# EAGLE design schematic (EAGLE 9.6.2)
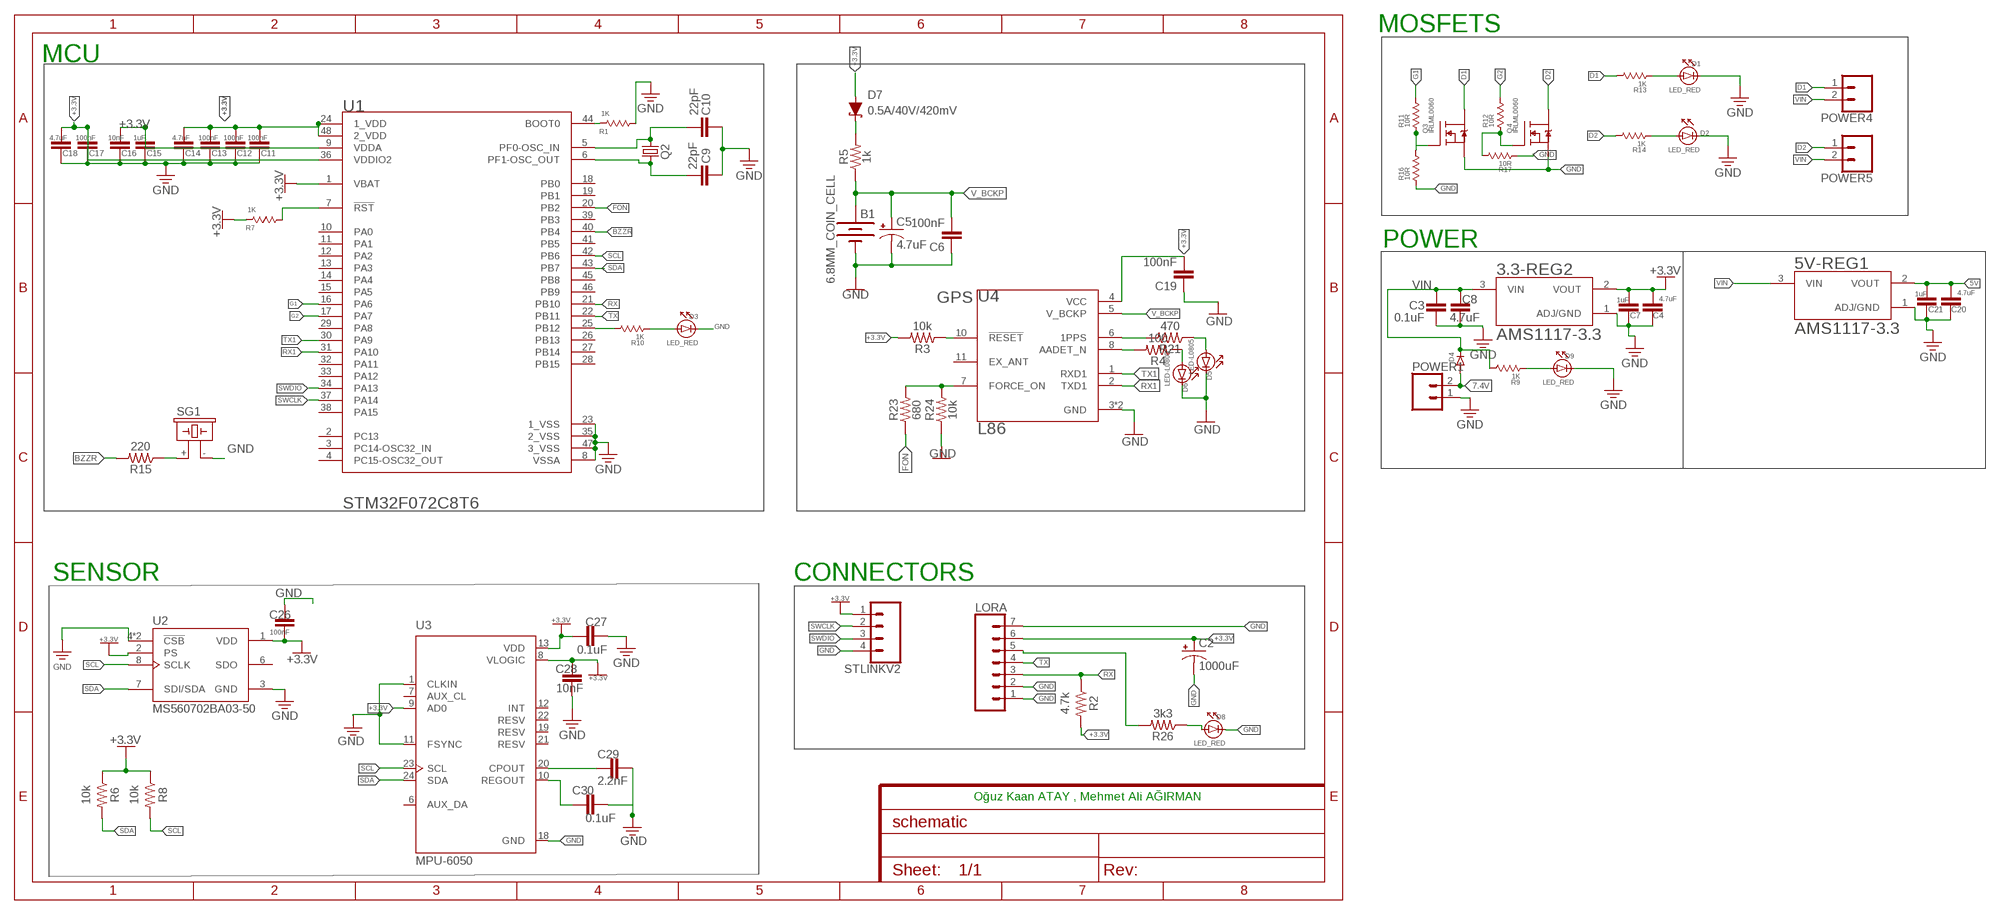
[diagram p0: schematic, sheet 1]

## Parts
3.3-REG2  AMS1117-3.3  [SOT229P700X180-4N]
5V-REG1  AMS1117-3.3  [SOT229P700X180-4N]
B1  6.8MM_COIN_CELL  BATTERY-6.8MM_SMD  [BATTCON-6.8MM]
C2  1000uF  CPOL-US150CLZ-1010  [150CLZ-1010]
C3  0.1uF  C_CHIP-0603(1608-METRIC)  [CAPC1608X85]
C4  4.7uF  C_CHIP-0603(1608-METRIC)  [CAPC1608X85]
C5  4.7uF  10UF-POLAR-EIA3216-16V-10%(TANT)  [EIA3216]
C6  100nF  1.0UF-0603-16V-10%  [0603]
C7  1uF  C_CHIP-0603(1608-METRIC)  [CAPC1608X85]
C8  4.7uF  C_CHIP-0603(1608-METRIC)  [CAPC1608X85]
C9  22pF  C_CHIP-0603(1608-METRIC)  [CAPC1608X85]
C10  22pF  C_CHIP-0603(1608-METRIC)  [CAPC1608X85]
C11  100nF  C_CHIP-0603(1608-METRIC)  [CAPC1608X85]
C12  100nF  C_CHIP-0603(1608-METRIC)  [CAPC1608X85]
C13  100nF  C_CHIP-0603(1608-METRIC)  [CAPC1608X85]
C14  4.7uF  C_CHIP-0603(1608-METRIC)  [CAPC1608X85]
C15  1uF  C_CHIP-0603(1608-METRIC)  [CAPC1608X85]
C16  10nF  C_CHIP-0603(1608-METRIC)  [CAPC1608X85]
C17  100nF  C_CHIP-0603(1608-METRIC)  [CAPC1608X85]
C18  4.7uF  C_CHIP-0603(1608-METRIC)  [CAPC1608X85]
C19  100nF  1.0UF-0603-16V-10%  [0603]
C20  4.7uF  C_CHIP-0603(1608-METRIC)  [CAPC1608X85]
C21  1uF  C_CHIP-0603(1608-METRIC)  [CAPC1608X85]
C26  100nF  C_CHIP-0603(1608-METRIC)  [CAPC1608X85]
C27  0.1uF  C_CHIP-0603(1608-METRIC)  [CAPC1608X85]
C28  10nF  C_CHIP-0603(1608-METRIC)  [CAPC1608X85]
C29  2.2nF  C_CHIP-0603(1608-METRIC)  [CAPC1608X85]
C30  0.1uF  C_CHIP-0603(1608-METRIC)  [CAPC1608X85]
D1  LED_RED  LED-L0805  [LED_0805]
D2  LED_RED  LED-L0805  [LED_0805]
D3  LED_RED  LED-L0805  [LED_0805]
D4  DIODE-SS14-DO214AC  [DO-214AC]
D5  LED-L0805  [LED_0805]
D6  LED-L0805  [LED_0805]
D7  0.5A/40V/420mV  DIODE-SCHOTTKY-PMEG4005EJ  [SOD-323]
D8  LED_RED  LED-L0805  [LED_0805]
D9  LED_RED  LED-L0805  [LED_0805]
LORA  CONN_07  [1X07]
POWER1  CONN_023.5MM-NO_SILK  [SCREWTERMINAL-3.5MM-2-NS]
POWER4  CONN_023.5MM-NO_SILK  [SCREWTERMINAL-3.5MM-2-NS]
POWER5  CONN_023.5MM-NO_SILK  [SCREWTERMINAL-3.5MM-2-NS]
Q2  CRYSTALHC49U70  [HC49U70]
Q3  IRLML0060  N_CH_MOSFET-SOT23  [SOT-23]
Q4  IRLML0060  N_CH_MOSFET-SOT23  [SOT-23]
R1  1K  RES-R0805  [RES_0805]
R2  4.7k  R-US_CHIP-0805(2012-METRIC)  [RESC2012X65]
R3  10k  1KOHM-0603-1/10W-1%  [0603]
R4  100  1KOHM-0603-1/10W-1%  [0603]
R5  1k  1KOHM-0603-1/10W-1%  [0603]
R6  10k  R-US_CHIP-0805(2012-METRIC)  [RESC2012X65]
R7  1K  RES-R0805  [RES_0805]
R8  10k  R-US_CHIP-0805(2012-METRIC)  [RESC2012X65]
R9  1K  RES-R0805  [RES_0805]
R10  1K  RES-R0805  [RES_0805]
R11  10R  RES-R0805  [RES_0805]
R12  10R  RES-R0805  [RES_0805]
R13  1K  RES-R0805  [RES_0805]
R14  1K  RES-R0805  [RES_0805]
R15  220  1KOHM-0603-1/10W-1%  [0603]
R16  10R  RES-R0805  [RES_0805]
R17  10R  RES-R0805  [RES_0805]
R21  470  1KOHM-0603-1/10W-1%  [0603]
R23  680  1KOHM-0603-1/10W-1%  [0603]
R24  10k  1KOHM-0603-1/10W-1%  [0603]
R26  3k3  1KOHM-0603-1/10W-1%  [0603]
SG1  F/CM12P  [F/CM12P]
STLINKV2  CONN_04  [1X04]
U1  STMICROELECTRONICS_STM32F072C8T6STMICROELECTRONICS_STM32F072C8T6_0_0  [STMICROELECTRONICS_STM32F072C8T6_0]
U2  MS560702BA03-50  [SON125P300X500X100-8N]
U3  MPU-6050  [QFN50P400X400X95-24N]
U4  L86  [XCVR_L86]

## Nets
5V: 5V-REG1.2(VOUT) C20.1 C21.1
7.4V: D4.A(ANOT) POWER1.2
+3.3V: 3.3-REG2.2(VOUT) C2.+ C4.1 C7.1 C11.1 C12.1 C13.1 C14.1 C15.1 C16.1 C17.1 C18.1 C19.2 C26.1 C27.2 C28.2 D7.A LORA.6 R2.2 R3.2 R6.1 R7.B R8.1 STLINKV2.1 U1.1(VBAT) U1.9(VDDA) U1.24(1_VDD) U1.36(VDDIO2) U1.48(2_VDD) U2.1(VDD) U2.2(PS) U3.8(VLOGIC) U3.9(AD0) U3.13(VDD) U4.4(VCC)
AUX: LORA.5 R26.2
BZZR: R15.2 U1.40(PB4)
D1: POWER4.1 Q3.3(D) R13.B
D2: POWER5.1 Q4.3(D) R14.B
FON: R23.1 U1.20(PB2)
G1: R11.B U1.16(PA6)
G2: R12.B U1.17(PA7)
GND: 3.3-REG2.1(ADJ/GND) 5V-REG1.1(ADJ/GND) B1.- C2.- C3.1 C4.2 C5.- C6.1 C7.2 C8.1 C9.2 C10.2 C11.2 C12.2 C13.2 C14.2 C15.2 C16.2 C17.2 C18.2 C19.1 C20.2 C21.2 C26.2 C27.1 C28.1 C29.1 C30.1 D1.K(KATOT) D2.K(KATOT) D3.K(KATOT) D5.K(KATOT) D6.K(KATOT) D8.K(KATOT) D9.K(KATOT) LORA.1 LORA.2 LORA.7 POWER1.1 Q3.2(S) Q4.2(S) R1.A R16.A R17.A R24.1 SG1.- STLINKV2.4 U1.8(VSSA) U1.23(1_VSS) U1.35(2_VSS) U1.47(3_VSS) U2.3(GND) U2.4(!CSB) U2.5(!CSB) U3.1(CLKIN) U3.11(FSYNC) U3.18(GND) U4.3(GND) U4.12(GND)
N$1: R3.1 U4.10(!RESET)
N$2: R4.2 U4.8(AADET_N)
N$3: D6.A(ANOT) R4.1
N$4: D7.C R5.2
N$5: R1.B U1.44(BOOT0)
N$6: C29.2 U3.20(CPOUT)
N$7: C30.2 U3.10(REGOUT)
N$8: D9.A(ANOT) R9.A
N$9: R7.A U1.7(!RST!)
N$10: D3.A(ANOT) R10.A
N$11: Q3.1(G) R11.A R16.B
N$12: R21.2 U4.6(1PPS)
N$13: D5.A(ANOT) R21.1
N$14: R15.1 SG1.+
N$15: Q4.1(G) R12.A R17.B
N$16: D2.A(ANOT) R14.A
N$17: D1.A(ANOT) R13.A
N$18: R10.B U1.25(PB12)
N$19: D8.A(ANOT) R26.1
N$20: R23.2 R24.2 U4.7(FORCE_ON)
RX: LORA.3 R2.1 U1.21(PB10)
RX1: U1.31(PA10) U4.2(TXD1)
SCL: R8.2 U1.42(PB6) U2.8(SCLK) U3.23(SCL)
SDA: R6.2 U1.43(PB7) U2.7(SDI/SDA) U3.24(SDA)
SWCLK: STLINKV2.2 U1.37(PA14)
SWDIO: STLINKV2.3 U1.34(PA13)
TX: LORA.4 U1.22(PB11)
TX1: U1.30(PA9) U4.1(RXD1)
V_BCKP: B1.+ C5.+ C6.2 R5.1 U4.5(V_BCKP)
VIN: 3.3-REG2.3(VIN) 5V-REG1.3(VIN) C3.2 C8.2 D4.K(KATOT) POWER4.2 POWER5.2 R9.B
XTAL1: C10.1 Q2.1 U1.5(PF0-OSC_IN)
XTAL2: C9.1 Q2.2 U1.6(PF1-OSC_OUT)
Unconnected: U1.2(PC13) U1.3(PC14-OSC32_IN) U1.4(PC15-OSC32_OUT) U1.10(PA0) U1.11(PA1) U1.12(PA2) U1.13(PA3) U1.14(PA4) U1.15(PA5) U1.18(PB0) U1.19(PB1) U1.26(PB13) U1.27(PB14) U1.28(PB15) U1.29(PA8) U1.32(PA11) U1.33(PA12) U1.38(PA15) U1.39(PB3) U1.41(PB5) U1.45(PB8) U1.46(PB9) U2.6(SDO) U3.6(AUX_DA) U3.7(AUX_CL) U3.12(INT) U3.19(RESV) U3.21(RESV) U3.22(RESV) U4.11(EX_ANT)

## Notes on the sheet
- MOSFETS
- MCU
- POWER
- GPS
- SENSOR | CONNECTORS
- Oğuz Kaan ATAY , Mehmet Ali AĞIRMAN

## Library data of the parts
3.3-REG2 5V-REG1 = AMS1117-3.3:AMS1117-3.3: Sot223/Pkg 1-Amp 3.3-Volt Low Drop Out Voltage Regulatator Check prices <https://pricing.snapeda.com/parts/AMS1117-3.3/AMD/view-part?ref=eda>; AVAILABILITY: In Stock; DESCRIPTION: LDO Voltage Regulators 800MA LDO LINEAR REG; MF: AMD; MP: AMS1117-3.3; PACKAGE: None; PRICE: None
B1 = SparkFun-Batteries:BATTERY: Battery - Single Cell A variety of battery chemistries, sizes, and footprints. Device List: 20MM_PTH - Coin Cell Battery Holder - 20mm (PTH) <https://www.sparkfun.com/products/783> 6.8MM_PTH - Coin Cell Battery Holder - 6.8MM(SMD) <https://www.digikey.com/product-detail/en/seiko-instruments/MS621FE-FL11E/728-1057-ND/1889208?WT.srch=1&gclid=CNOQ5a6LzdQCFZS2wAodXCkE0g> 12MM_SMD - Coin Cell Battery Holder - 12mm (SMD) <https://www.sparkfun.com/products/10592> 12MM_PTH - Coin Cell Battery Holder - 12mm (PTH) <https://www.sparkfun.com/products/7948> 20MM_SMD - 20mm Coin Cell Battery Holder (SMD) (2 legs) Used on the Big Time Watch Kit <https://www.sparkfun.com/products/11734> 20MM_SMD_4LEGS - Coin Cell Battery Holder - 20mm (SMD) <https://www.sparkfun.com/products/11892> 20MM_SMD_4LEGS_OVERPASTE - Coin Cell Battery Holder - 20mm (SMD) <https://www.sparkfun.com/products/11892> (Over-paste on the legs) 24.5MM_PTH - Coin Cell Battery Holder - 24.5mm (PTH) <https://www.sparkfun.com/products/8863> 9V - 9V Battery Holder - PC Mount Used on the SparkFun SparkPunk Sound Kit <https://www.sparkfun.com/products/11177> and SparkFun SparkPunk Sequencer Kit <https://www.sparkfun.com/products/12707> 18650 - Battery Holder - 18650 (PTH) <https://www.sparkfun.com/products/13113> AA - Battery Holder - 1xAA (PTH) <https://www.sparkfun.com/products/7949> AAA - Battery Holder - 1xAAA (PTH) <https://www.sparkfun.com/products/12718> AA_KIT - Battery Holder - 1xAA (PTH) <https://www.sparkfun.com/products/7949> Special kit package - pads only have exposed copper on one side of the board. AAA_KIT - Battery Holder - 1xAAA (PTH) <https://www.sparkfun.com/products/12718> Special kit package - pads only have exposed copper on one side of the board.; PROD_ID: BATT-13734
C2 = adafruit:CPOL-US: POLARIZED CAPACITOR, American symbol
C3 C4 C7-C18 C20 C21 C26-C30 = Capacitor:C: Capacitor - Generic; CATEGORY: Capacitor
C5 = SparkFun-Capacitors:10UF-POLAR: 10.0µF polarized capacitors A capacitor is a passive two-terminal electrical component used to store electrical energy temporarily in an electric field.; PROD_ID: CAP-00811; VALUE: 10uF
C6 C19 = SparkFun-Capacitors:1.0UF: 1µF ceramic capacitors A capacitor is a passive two-terminal electrical component used to store electrical energy temporarily in an electric field.; PROD_ID: CAP-00868; VALUE: 1.0uF
D1-D3 D5 D6 D8 D9 = OmrBrk:LED
D4 = OmrBrk:DIODE
D7 = SparkFun-DiscreteSemi:DIODE-SCHOTTKY: Schottky diode A Schottky diode is a semiconductor diode which has a low forward voltage drop and a very fast switching action.; PROD_ID: DIO-10955
LORA = SparkFun-Connectors:CONN_07: Multi connection point. Often used as Generic Header-pin footprint for 0.1 inch spaced/style header connections On any of the 0.1 inch spaced packages, you can populate with these: Break Away Headers - Straight <https://www.sparkfun.com/products/116> (PRT-00116) Break Away Male Headers - Right Angle <https://www.sparkfun.com/products/553> (PRT-00553) Female Headers <https://www.sparkfun.com/products/115> (PRT-00115) Break Away Headers - Machine Pin <https://www.sparkfun.com/products/117> (PRT-00117) Break Away Female Headers - Swiss Machine Pin <https://www.sparkfun.com/products/743> (PRT-00743) For SCREWTERMINALS and SPRING TERMINALS visit here: Screw Terimnals on SparkFun.com <https://www.sparkfun.com/search/results?term=Screw+Terminals> (5mm/3.5mm/2.54mm spacing) This device is also useful as a general connection point to wire up your design to another part of your project. Our various solder wires solder well into these plated through hole pads. Hook-Up Wire - Assortment (Stranded, 22 AWG) <https://www.sparkfun.com/products/11375> (PRT-11375) Hook-Up Wire - Assortment (Solid Core, 22 AWG) <https://www.sparkfun.com/products/11367> (PRT-11367) View the entire wire category on our website here <https://www.sparkfun.com/categories/141> Special notes: Molex polarized connector foot print use with SKU : PRT-08231 with associated crimp pins and housings. 1MM SMD Version SKU: PRT-10208 NOTES ON THE VARIANTS LOCK and LOCK_LONGPADS... This footprint was designed to help hold the alignment of a through-hole component (i.e. 6-pin header) while soldering it into place. You may notice that each hole has been shifted either up or down by 0.005 of an inch from it's more standard position (which is a perfectly straight line). This slight alteration caused the pins (the squares in the middle) to touch the edges of the holes. Because they are alternating, it causes a "brace" to hold the component in place. 0.005 has proven to be the perfect amount of "off-center" position when using our standard breakaway headers. Although looks a little odd when you look at the bare footprint, once you have a header in there, the alteration is very hard to notice. Also,if you push a header all the way into place, it is covered up entirely on the bottom side.
POWER1 POWER4 POWER5 = SparkFun-Connectors:CONN_02: Multi connection point. Often used as Generic Header-pin footprint for 0.1 inch spaced/style header connections On any of the 0.1 inch spaced packages, you can populate with these: Break Away Headers - Straight <https://www.sparkfun.com/products/116> (PRT-00116) Break Away Male Headers - Right Angle <https://www.sparkfun.com/products/553> (PRT-00553) Female Headers <https://www.sparkfun.com/products/115> (PRT-00115) Break Away Headers - Machine Pin <https://www.sparkfun.com/products/117> (PRT-00117) Break Away Female Headers - Swiss Machine Pin <https://www.sparkfun.com/products/743> (PRT-00743) For SCREWTERMINALS and SPRING TERMINALS visit here: Screw Terimnals on SparkFun.com <https://www.sparkfun.com/search/results?term=Screw+Terminals> (5mm/3.5mm/2.54mm spacing) This device is also useful as a general connection point to wire up your design to another part of your project. Our various solder wires solder well into these plated through hole pads. Hook-Up Wire - Assortment (Stranded, 22 AWG) <https://www.sparkfun.com/products/11375> (PRT-11375) Hook-Up Wire - Assortment (Solid Core, 22 AWG) <https://www.sparkfun.com/products/11367> (PRT-11367) View the entire wire category on our website here <https://www.sparkfun.com/categories/141> Special notes: Molex polarized connector foot print use with: PRT-08233 with associated crimp pins and housings. 2.54_SCREWTERM for use with PRT-10571. 3.5mm Screw Terminal footprints for PRT-08084 5mm Screw Terminal footprints for use with PRT-08432; PROD_ID: CONN-08399
Q2 = crystal:CRYSTAL: CRYSTAL; OC_FARNELL: unknown; OC_NEWARK: unknown
Q3 Q4 = OmrBrk:N_CH_MOSFET
R1 R7 R9-R14 R16 R17 = OmrBrk:RES
R2 R6 R8 = Resistor:R-US: Resistor Fixed - ANSI; CATEGORY: Resistor; SUB-CATEGORY: Fixed
R3 R4 R15 R21 R23 R24 R26 = SparkFun-Resistors:1KOHM: 1kΩ resistor A resistor is a passive two-terminal electrical component that implements electrical resistance as a circuit element. Resistors act to reduce current flow, and, at the same time, act to lower voltage levels within circuits. - Wikipedia; PROD_ID: RES-07856; VALUE: 1k
R5 = SparkFun-Resistors:1KOHM: 1kΩ resistor A resistor is a passive two-terminal electrical component that implements electrical resistance as a circuit element. Resistors act to reduce current flow, and, at the same time, act to lower voltage levels within circuits. - Wikipedia; PROD_ID: RES-07856
SG1 = buzzer:F/CM12P: BUZZER Source: Buerklin; OC_FARNELL: unknown; OC_NEWARK: unknown
STLINKV2 = SparkFun-Connectors:CONN_04: Multi connection point. Often used as Generic Header-pin footprint for 0.1 inch spaced/style header connections On any of the 0.1 inch spaced packages, you can populate with these: Break Away Headers - Straight <https://www.sparkfun.com/products/116> (PRT-00116) Break Away Male Headers - Right Angle <https://www.sparkfun.com/products/553> (PRT-00553) Female Headers <https://www.sparkfun.com/products/115> (PRT-00115) Break Away Headers - Machine Pin <https://www.sparkfun.com/products/117> (PRT-00117) Break Away Female Headers - Swiss Machine Pin <https://www.sparkfun.com/products/743> (PRT-00743) For SCREWTERMINALS and SPRING TERMINALS visit here: Screw Terimnals on SparkFun.com <https://www.sparkfun.com/search/results?term=Screw+Terminals> (5mm/3.5mm/2.54mm spacing) This device is also useful as a general connection point to wire up your design to another part of your project. Our various solder wires solder well into these plated through hole pads. Hook-Up Wire - Assortment (Stranded, 22 AWG) <https://www.sparkfun.com/products/11375> (PRT-11375) Hook-Up Wire - Assortment (Solid Core, 22 AWG) <https://www.sparkfun.com/products/11367> (PRT-11367) View the entire wire category on our website here <https://www.sparkfun.com/categories/141> Special notes: Molex polarized connector foot print use with SKU : PRT-08231 with associated crimp pins and housings. 1MM SMD Version SKU: PRT-10208; PROD_ID: CONN-09696
U1 = STMicroelectronics - STM32F072C8T6:STMICROELECTRONICS_STM32F072C8T6: Mainstream ARM Cortex-M0 USB line MCU with 64 Kbytes Flash, 48 MHz CPU, USB, CAN and CEC functions; CENTROID_NOT_SPECIFIED: No; DATASHEET: https://upverter.com/datasheet/79bc43d7022f169b66e7860c54ba7646fa9c2dde.pdf; DIGIKEY_DESCRIPTION: IC MCU 32BIT 64KB FLASH 48LQFP; DIGIKEY_PART_NUMBER: STM32F072C8T6-ND; LEAD_FREE: yes; MF: STMicroelectronics; MOUSER_PART_NUMBER: 511-STM32F072C8T6; MPN: STM32F072C8T6; PACKAGE: LQFP48; PREFIX: U; ROHS: yes; TEMPERATURE_RANGE_HIGH: +85°C; TEMPERATURE_RANGE_LOW: -40°C
U2 = MS560702BA03-50:MS560702BA03-50: BAROMETRIC PRESSURE SENSOR Check prices <https://pricing.snapeda.com/parts/MS560702BA03-50/TE%20Connectivity/view-part?ref=eda>; AVAILABILITY: In Stock; COMMENT: MS560702BA03-50; DESCRIPTION: MS5607-02BA03 Series 3 V 1 to 120 kPa Absolute Barometric Pressure Sensor; MF: TE Connectivity; MP: MS560702BA03-50; PACKAGE: SMD-8 Measurement Specialties; PRICE: None; PURCHASE-URL: https://pricing.snapeda.com/search/part/MS560702BA03-50/?ref=eda
U3 = MPU-6050:MPU-6050: MPU-6050 Six-Axis (Gyro + Accelerometer) MEMS MotionTracking™ Devices Check prices <https://pricing.snapeda.com/parts/MPU-6050/TDK%20InvenSense/view-part?ref=eda>; AVAILABILITY: In Stock; DESCRIPTION: MPU-6050 series Accelerometer, Gyroscope, 3 Axis Sensor Evaluation Board; MF: TDK InvenSense; MP: MPU-6050; PACKAGE: VFQFN-24 TDK InvenSense; PRICE: None; PURCHASE-URL: https://pricing.snapeda.com/search/part/MPU-6050/?ref=eda
U4 = L86:L86: L86 is an ultra-compact GNSS POT (Patch on Top) module with an embedded 18.4mm × 18.4mm × 4.0mm patch antenna and utilizes the MediaTek new generation GNSS chipset MT3333 that achieves the perfect performance; AVAILABILITY: Unavailable; DESCRIPTION: L86 is an ultra-compact GNSS POT (Patch on Top) module with an embedded 18.4mm × 18.4mm × 4.0mm patch antenna and utilizes the MediaTek new generation GNSS chipset MT3333 that achieves the perfect performance; MF: Quectel; MP: L86; PACKAGE: PowerSFN-8 Quectel; PRICE: None

## Board
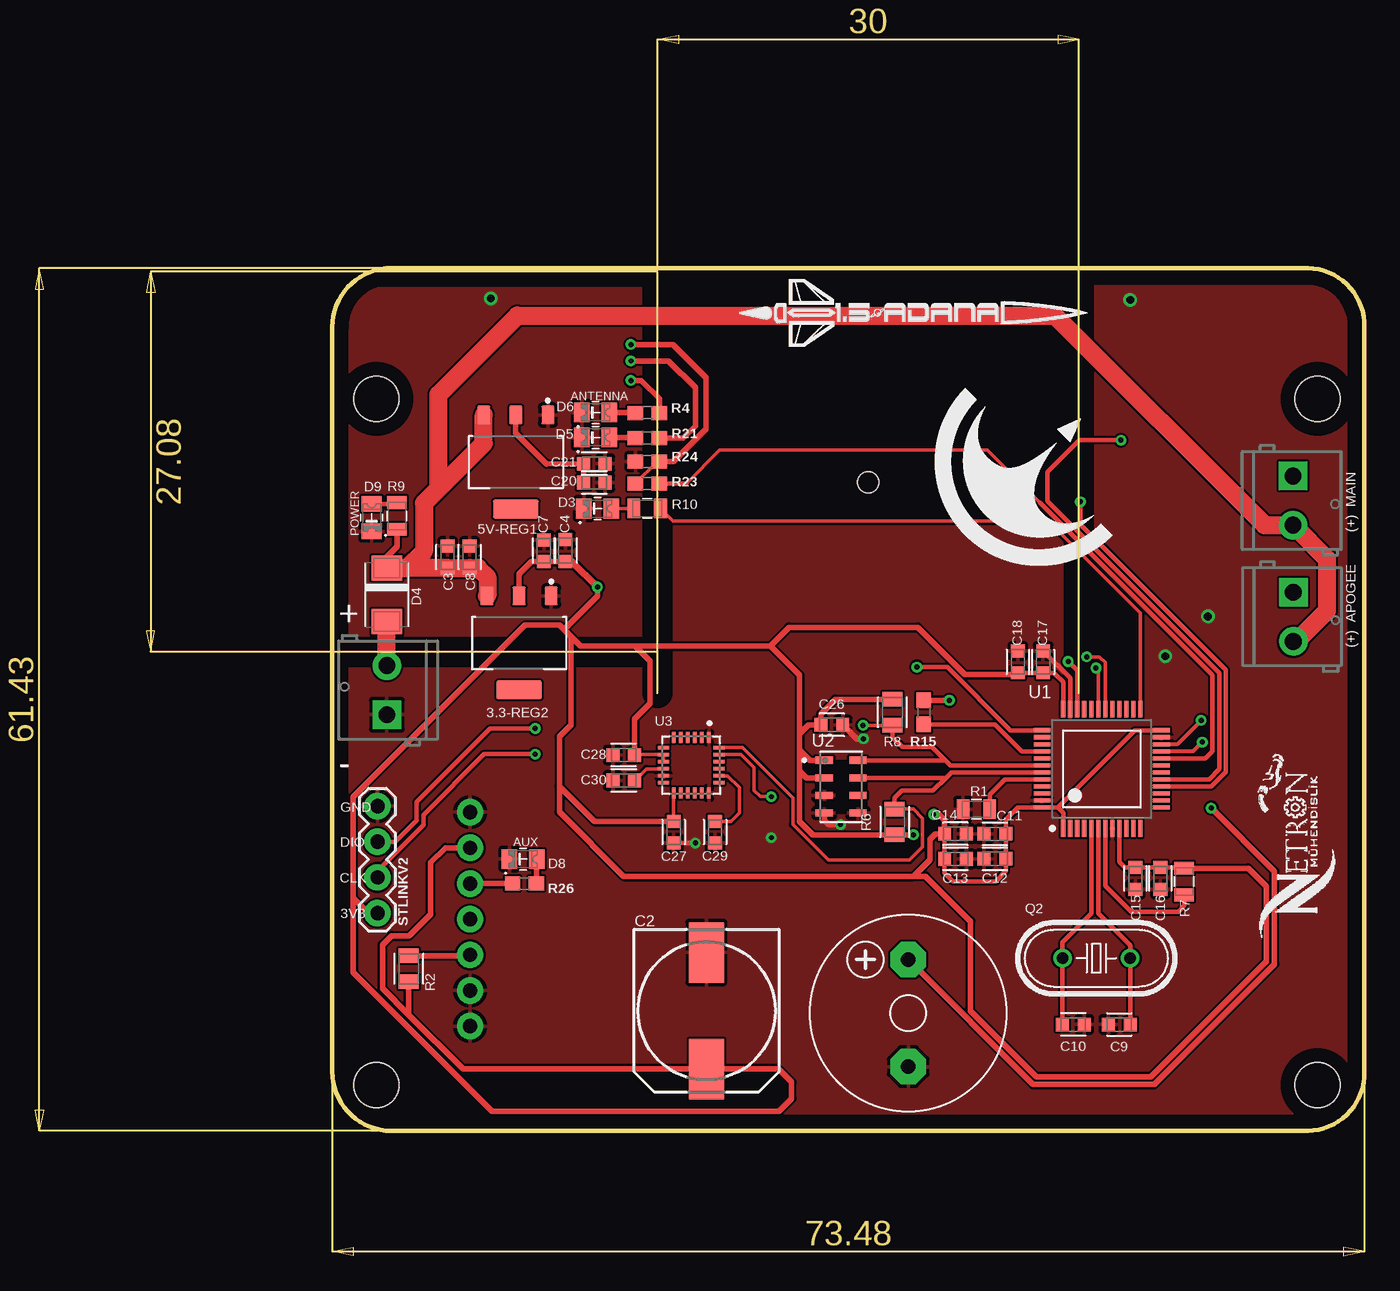
[diagram p1: board, top side]
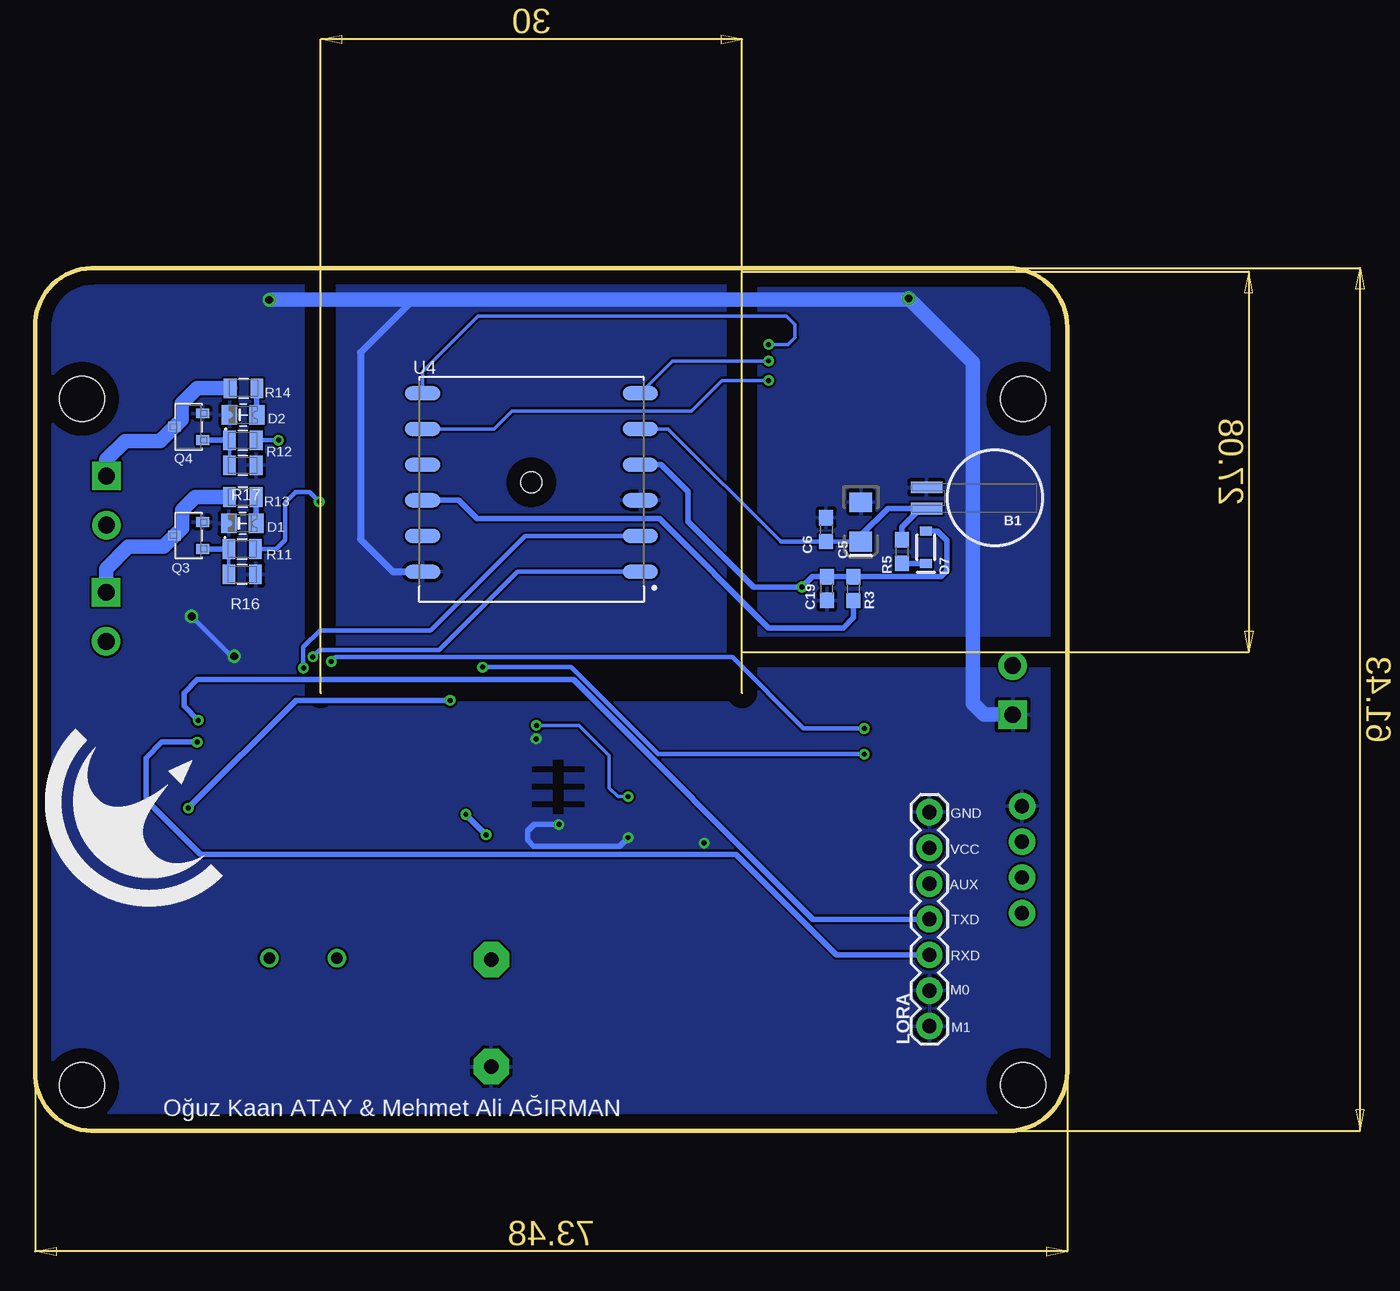
[diagram p2: board, bottom side, seen from below]

Size 73.48 x 61.42 mm. Coordinates in mm from the lower left corner, seen from the top.
Outline: 4.2,0 69.48,0 arc90 73.48,4.2 73.48,57.22 arc90 69.48,61.42 4.2,61.42 arc90 0,57.23 0,4.21 arc90 4.2,0
Copper layers (1*16): Top 0.035mm / dielectric 1.5mm / Bottom 0.035mm
Design rules "default": minimum track width 6mil, minimum drill 0.35mm, track to track 6mil, track to pad 6mil, pad to pad 6mil, via to via 6mil, smd to smd 6mil, copper to edge 40mil, drill to drill 6mil, minimum pad ring 10mil, minimum via ring 8mil, stop-mask expansion 4mil, vias tented up to drill 0mil, thermal gap 10mil
Holes 3.2 mm at 3.14,52.11 3.14,3.26 70.15,3.26 70.15,52.11
Holes 1.5 mm at 38.14,46.16
bKeepout: area 36.5,44.6 to 39.8,47.8
vRestrict: area 82.1,55.2 to 82.7,56.7; area 82.1,59.7 to 82.7,61.2; area 80.2,57.5 to 82,58.9; 3 lines

### Footprints (pad centres in the part's own frame; a part is rotated, then mirrored left to right if it is on the bottom)
SOT229P700X180-4N = smd 0.93 x 1.31: 1 -2.29,-3.345; 2 0,-3.345; 3 2.29,-3.345 | smd 3.24 x 1.31: 4 0,3.345
BATTCON-6.8MM = smd 2.25 x 0.85: + 4.87,0.75; - 4.87,-0.75
150CLZ-1010 = smd 4.3 x 2.5: + 4.15,0; - -4.15,0
CAPC1608X85 = smd 0.921 x 0.97: 1 -0.775,0; 2 0.775,0
EIA3216 = smd 1.4 x 1.6: + 1.4,0; - -1.4,0
0603 = smd 1.1 x 1: 1 -0.85,0; 2 0.85,0
LED_0805 = smd 1.1 x 1.4: A 0.975,0; K -0.975,0
DO-214AC = smd 1.8 x 2.2: A 1.9,0; K -1.9,0
SOD-323 = smd 0.63 x 0.83: A 1.15,0; C -1.15,0
1X07 = drill 1.016 pad 1.88: 1 0,0; 2 2.54,0; 3 5.08,0; 4 7.62,0; 5 10.16,0; 6 12.7,0; 7 15.24,0
SCREWTERMINAL-3.5MM-2-NS = drill 1.2 pad 2.032 square: 1 0,0 | drill 1.2 pad 2.032: 2 3.5,0
HC49U70 = drill 0.813: 1 -2.413,0; 2 2.413,0
SOT-23 = smd 0.7 x 0.9: 1 -0.95,-1; 2 0.95,-1; 3 0,1
RES_0805 = smd 0.9 x 1.4: A -0.95,0; B 0.95,0
RESC2012X65 = smd 1.031 x 1.42: 1 -0.919,0; 2 0.919,0
F/CM12P = drill 1.016 pad 2.54 octagon: + 3.81,0; - -3.81,0
1X04 = drill 1.016 pad 1.88: 1 0,0; 2 2.54,0; 3 5.08,0; 4 7.62,0
STMICROELECTRONICS_STM32F072C8T6_0 = smd 1.2 x 0.3: 1 -4.25,2.75; 2 -4.25,2.25; 3 -4.25,1.75; 4 -4.25,1.25; 5 -4.25,0.75; 6 -4.25,0.25; 7 -4.25,-0.25; 8 -4.25,-0.75; 9 -4.25,-1.25; 10 -4.25,-1.75; 11 -4.25,-2.25; 12 -4.25,-2.75; 25 4.25,-2.75; 26 4.25,-2.25; 27 4.25,-1.75; 28 4.25,-1.25; 29 4.25,-0.75; 30 4.25,-0.25; 31 4.25,0.25; 32 4.25,0.75; 33 4.25,1.25; 34 4.25,1.75; 35 4.25,2.25; 36 4.25,2.75 | smd 0.3 x 1.2: 13 -2.75,-4.25; 14 -2.25,-4.25; 15 -1.75,-4.25; 16 -1.25,-4.25; 17 -0.75,-4.25; 18 -0.25,-4.25; 19 0.25,-4.25; 20 0.75,-4.25; 21 1.25,-4.25; 22 1.75,-4.25; 23 2.25,-4.25; 24 2.75,-4.25; 37 2.75,4.25; 38 2.25,4.25; 39 1.75,4.25; 40 1.25,4.25; 41 0.75,4.25; 42 0.25,4.25; 43 -0.25,4.25; 44 -0.75,4.25; 45 -1.25,4.25; 46 -1.75,4.25; 47 -2.25,4.25; 48 -2.75,4.25
SON125P300X500X100-8N = smd 1.31 x 0.53: 1 -1.2,1.875; 2 -1.2,0.625; 3 -1.2,-0.625; 4 -1.2,-1.875; 5 1.2,-1.875; 6 1.2,-0.625; 7 1.2,0.625; 8 1.2,1.875
QFN50P400X400X95-24N = smd 0.79 x 0.26: 1 -1.97,1.25; 2 -1.97,0.75; 3 -1.97,0.25; 4 -1.97,-0.25; 5 -1.97,-0.75; 6 -1.97,-1.25; 13 1.97,-1.25; 14 1.97,-0.75; 15 1.97,-0.25; 16 1.97,0.25; 17 1.97,0.75; 18 1.97,1.25 | smd 0.26 x 0.79: 7 -1.25,-1.97; 8 -0.75,-1.97; 9 -0.25,-1.97; 10 0.25,-1.97; 11 0.75,-1.97; 12 1.25,-1.97; 19 1.25,1.97; 20 0.75,1.97; 21 0.25,1.97; 22 -0.25,1.97; 23 -0.75,1.97; 24 -1.25,1.97
XCVR_L86 = smd 2.5 x 1: 1 -7.75,6.35; 2 -7.75,3.81; 3 -7.75,1.27; 4 -7.75,-1.27; 5 -7.75,-3.81; 6 -7.75,-6.35; 7 7.75,-6.35; 8 7.75,-3.81; 9 7.75,-1.27; 10 7.75,1.27; 11 7.75,3.81; 12 7.75,6.35

### Placement (x,y rotation side)
3.3-REG2  13.29,34.74 180 top
5V-REG1  13.07,47.62 180 top
B1  5.15,45.07 180 bottom
C2  26.64,8.55 270 top
C3  8.2,40.85 270 top
C4  16.6,41.32 90 top
C5  14.69,43.36 270 bottom
C6  17.16,42.81 270 bottom
C7  15.06,41.3 90 top
C8  9.78,40.85 270 top
C9  56.03,7.57 180 top
C10  52.76,7.57 0 top
C11  47.18,21.14 180 top
C12  47.18,19.37 180 top
C13  44.37,19.36 0 top
C14  44.37,21.15 0 top
C15  57.18,17.97 270 top
C16  58.96,17.97 270 top
C17  50.61,33.39 90 top
C18  48.81,33.39 90 top
C19  17.11,38.61 90 bottom
C20  18.65,46.15 0 top
C21  18.65,47.5 0 top
C26  35.57,28.91 0 top
C27  24.3,21.27 90 top
C28  20.75,26.76 0 top
C29  27.25,21.27 90 top
C30  20.75,24.94 0 top
D1  58.72,43.25 0 bottom
D2  58.67,50.97 0 bottom
D3  18.89,44.3 0 top
D4  3.88,38.17 270 top
D5  18.75,49.37 0 top
D6  18.75,51.15 0 top
D7  10.06,41.55 90 bottom
D8  13.58,19.35 0 top
D9  2.8,43.66 90 top
LORA  9.81,7.45 90 bottom
POWER1  3.88,29.63 90 top
POWER4  68.43,38.35 270 top
POWER5  68.4,46.63 270 top
Q2  54.4,12.29 0 top
Q3  62.55,42.39 90 bottom
Q4  62.55,50.13 90 bottom
R1  45.86,22.9 0 top
R2  5.44,11.54 270 top
R3  15.21,38.61 90 bottom
R4  22.43,51.12 0 top
R5  11.78,41.25 270 bottom
R6  40.04,21.99 90 top
R7  60.65,17.75 90 top
R8  39.89,29.8 270 top
R9  4.6,43.78 270 top
R10  22.42,44.32 0 top
R11  58.74,41.42 0 bottom
R12  58.69,49.17 0 bottom
R13  58.69,45.13 180 bottom
R14  58.64,52.88 180 bottom
R15  42.11,29.8 270 top
R16  58.74,39.62 180 bottom
R17  58.69,47.39 180 bottom
R21  22.43,49.31 0 top
R23  22.41,46.08 180 top
R24  22.43,47.66 0 top
R26  13.68,17.61 180 top
SG1  41,8.38 90 top
STLINKV2  3.22,15.5 90 top
U1  54.78,25.77 90 top
U2  36.23,24.51 0 top
U3  25.55,26.03 270 top
U4  38.14,46.16 180 bottom

### Tracks (layer width: path | path; a pad name or v marks a point on that pad's centre or on a via)
5V
  Top 0.406: 5V-REG1.2 13.07,49.66 15.25,47.48 C21.1 C20.1
7.4V
  Top 1.27: POWER1.2 D4.A
+3.3V  (via drill 0.35)
  Top 0.254: C28.2 21.55,26.78 U3.8 U3.9 | C27.2 U3.13
  Top 0.305: U1.9 56.03,19.14 56.43,18.74 C15.1 C16.1 60.61,18.74 R7.B | C18.1 C17.1 51.37,32.62 52.03,31.95 U1.36 | C14.1 C13.1 43.6,18.37 44.19,17.77 47.24,17.77 47.96,18.49 C12.1 C11.1 47.96,22.18 48.8,23.02 U1.48 51.64,23.02 | U1.1 52.03,22.63 51.64,23.02 | 51.64,23.02 57.14,28.52 U1.24
  Top 0.406: 3.3-REG2.2 13.29,39.63 14.19,40.53 C7.1 16.59,40.53 C4.1 | 1.49,16.57 1.49,23.77 13.74,36.02 16.18,36.02 16.49,35.7 | 1.49,16.57 1.49,11.27 11.38,1.38 31.81,1.38 32.71,2.28 32.71,3.47 31.78,4.4 C2.+ 9.3,4.4 5.44,8.26 | STLINKV2.1 2.56,15.5 1.49,16.57 | 5.44,8.26 R2.2 | 5.44,8.26 3.58,10.13 3.58,13.25 4.21,13.89 5.48,13.89 7,15.41 7,19.09 8.06,20.15 LORA.6 | C27.2 18.66,22.04 16.18,24.53 | 33.27,28.26 33.27,27.12 | 33.27,27.12 34.01,26.38 U2.1 | 33.27,28.26 33.91,28.91 C26.1 34.79,29.69 35.82,30.72 R8.1 | 33.27,27.12 33.27,25.62 | U2.2 33.76,25.13 33.27,25.62 | 21.55,34.53 31.19,34.53 | C18.1 48.7,32.51 45.03,32.51 41.69,35.85 32.51,35.85 31.19,34.53 | 21.55,34.53 22.63,33.45 22.63,30.42 21.52,29.32 C28.2 | 16.18,24.53 16.18,22.7 20.75,18.13 41.37,18.13 | 41.37,18.13 42.54,19.3 42.54,20.75 42.95,21.15 C14.1 43.6,22.12 43.2,22.52 v42.82,22.52 | 33.27,25.62 33.27,22.02 34.21,21.07 R6.1 v41.37,21.07 v41.37,21.08 | R7.B 65.21,18.7 66.49,17.42 66.49,12.06 58.28,3.85 50.13,3.85 45.44,8.55 45.44,14.93 42.23,18.13 41.37,18.13 | 16.49,35.7 17.01,35.18 | 16.18,24.53 16.18,28.06 17.01,28.9 17.01,35.18 | 33.27,28.26 33.27,32.44 31.19,34.53 | 16.49,35.7 18.87,38.09 v18.87,38.72 | 17.01,35.18 17.67,34.53 21.55,34.53
  Top 0.508: C4.1 17.05,40.54 v18.87,38.72
  Bottom 0.406: R3.2 | R3.2 C19.2 18.13,39.46 v18.87,38.72 22.34,38.72 27,43.38 27,45.51 28.92,47.44 U4.4 | D7.A 9.25,42.7 8.58,42.04 8.58,39.88 9,39.46 R3.2 | v41.37,21.08 v42.82,22.52
AUX
  Top 0.406: LORA.5 R26.2
BZZR
  Top 0.305: R15.2 47.19,28.95 49.11,27.02 U1.40
D1
  Bottom 1.016: POWER4.1 68.43,40.02 66.85,41.6 64.34,41.6 Q3.3 63.02,42.92 63.02,44.19 62.08,45.13 R13.B
D2
  Bottom 1.016: POWER5.1 68.4,47.79 67.08,49.12 64.57,49.12 Q4.3 63.05,50.64 63.05,51.78 61.94,52.88 R14.B
FON
  Top 0.254: 50.36,44.75 46.66,48.45 27.58,48.45 25.21,46.08
  Top 0.305: R23.1 25.21,46.08 | 50.36,44.75 62.66,32.46 62.66,27.02 62.16,26.52 U1.20
G1  (via drill 0.35)
  Top 0.305: U1.16 62.58,24.52 63.62,25.56 63.62,32.8 53.26,43.16 v53.26,44.8
  Bottom 0.305: v53.26,44.8 53.94,45.49 54.94,45.49 55.7,44.72 55.7,42.06 56.33,41.42 R11.B
G2  (via drill 0.35)
  Top 0.305: U1.17 62.44,25.02 63.16,25.75 63.16,32.61 50.92,44.85 50.92,46.91 53.18,49.17 v56.15,49.17
  Bottom 0.305: v56.15,49.17 R12.B
GND  (via drill 0.35, 0.55)
  Top 0.305: C27.1 v25.85,20.49 | U1.35 52.53,32.24 C17.2
  Top 0.406: U2.4 35.03,22.1 35.31,21.81 v36.19,21.81 | C26.2 37.34,27.91 v37.81,27.91
  Bottom 0.305: v62.34,36.63 59.51,33.79 v59.31,33.79
  Bottom 0.406: v36.19,21.81 37.97,21.81 38.42,21.36 38.42,20.7 37.99,20.26 31.87,20.26 v31.26,20.87
  Bottom 0.508: U4.12 48.02,39.81 50.31,42.11 50.31,55.42 46.55,59.18
  Bottom 1.016: 56.66,59.18 46.55,59.18 11.39,59.18 v11.29,59.28 6.72,54.71 6.72,30.43 5.91,29.63 POWER1.1
  other vias: 56.82,59.17
  pour Top: -0.74,65.52 74.37,65.52 74.37,-1.23 -0.74,-1.23
  pour Bottom: 23.14,61.16 53.14,61.16 53.14,31.16 23.14,31.16
  pour Bottom: -0.6,65.45 22.4,65.45 22.4,30.45 54.4,30.45 54.4,65.45 74.4,65.45 74.4,-1.55 -0.6,-1.55
N$1
  Bottom 0.406: R3.1 15.21,36.55 15.95,35.81 21.26,35.81 29.03,43.58 42.03,43.58 43.35,44.89 U4.10
N$2  (via drill 0.35)
  Top 0.406: R4.2 23.28,52.12 21.98,53.43 v21.25,53.43
  Bottom 0.254: v21.25,53.43 24.57,53.43 26.74,51.25 39.54,51.25 40.82,49.97 U4.8
  Bottom 0.305: U4.8
N$3
  Top 0.406: D6.A 21.55,51.15 R4.1
N$4
  Bottom 0.406: D7.C R5.2
N$5
  Top 0.305: U1.44 47.88,25.02 46.81,23.95 R1.B
N$6
  Top 0.254: C29.2 28.39,22.04 28.98,22.63 28.98,24.45 28.15,25.28 U3.20
N$7
  Top 0.254: C30.2 22.37,25.78 U3.10
N$8
  Top 0.305: R9.A 4.5,44.63 D9.A
N$9
  Top 0.305: U1.7 55.03,17.45 56.88,15.6 60.22,15.6 60.66,16.04 R7.A
N$10
  Top 0.254: D3.A R10.A
N$11
  Bottom 0.254: R16.B R11.A
  Bottom 0.406: R11.A 61.54,41.42 Q3.1
N$12  (via drill 0.35)
  Top 0.406: R21.2 24.98,49.31 25.86,50.18 25.86,52.92 23.96,54.82 v21.25,54.82
  Bottom 0.254: v21.25,54.82 28.09,54.82 U4.6
N$13
  Top 0.406: D5.A 21.52,49.37 R21.1
N$14  (via drill 0.35)
  Top 0.406: SG1.+ 49.9,3.3 58.52,3.3 67.08,11.86 67.08,18.48 v62.58,22.98 | v43.94,30.65 R15.1
  Bottom 0.406: v62.58,22.98 54.91,30.65 v43.94,30.65
N$15
  Bottom 0.254: R17.B R12.A
  Bottom 0.406: Q4.1 61.54,49.17 R12.A
N$16
  Bottom 0.406: D2.A R14.A
N$17
  Bottom 0.406: D1.A R13.A
N$18
  Top 0.254: U1.25 57.53,36.87 50.98,43.42 24.27,43.42 R10.B
N$19
  Top 0.406: R26.1 14.53,19.32 D8.A
N$20  (via drill 0.35)
  Top 0.254: R23.2 23.14,47.66 R24.2
  Top 0.406: R24.2 24.3,47.66 26.61,49.97 26.61,53.64 24.26,55.99 v21.26,55.99
  Bottom 0.254: v21.26,55.99 19.87,55.99 19.37,56.48 19.37,57.4 19.98,58.01 41.93,58.01 45.89,54.04 U4.7
RX  (via drill 0.35)
  Top 0.279: v61.94,27.68 61.28,27.02 U1.21
  Top 0.406: LORA.3 9.74,12.46 R2.1
  Bottom 0.406: LORA.3 16.44,12.53 23.59,19.68 61.69,19.68 65.58,23.56 65.58,26.56 64.46,27.68 v61.94,27.68
RX1  (via drill 0.35)
  Top 0.254: v54.38,32.95 54.53,32.8 U1.31
  Bottom 0.305: U4.2 38.59,42.35 45.31,35.63 53.21,35.63 54.4,34.44 54.4,32.98 v54.38,32.95
SCL  (via drill 0.35)
  Top 0.254: U3.23 29.11,26.78 30.02,25.88 30.02,24.25 30.47,23.79 v31.26,23.79 | v37.79,28.87 v37.79,28.88 R8.2
  Top 0.305: U2.8 43.64,26.38 | U1.42 44,26.02 43.64,26.38 | R8.2 39.89,28.02 40.58,27.32 42.69,27.32 43.64,26.38
  Bottom 0.254: v31.26,23.79 31.97,23.79 32.61,24.43 32.61,26.71 34.77,28.87 v37.79,28.87
SDA
  Top 0.254: U3.24 29.22,27.28 32.79,23.72 32.79,21.81 35.33,19.27 41.09,19.27 42.03,20.21 42.03,22.24 41.36,22.91 R6.2
  Top 0.305: U2.7 43.67,25.13 | U1.43 44.06,25.52 43.67,25.13 | R6.2 40.04,23.7 40.56,24.23 42.77,24.23 43.67,25.13
SWCLK  (via drill 0.35)
  Top 0.305: STLINKV2.2 3.22,18.51 6.5,21.79 6.5,22.5 10.82,26.82 v14.45,26.82 | v41.62,33.01 43.78,33.01 48.28,28.52 U1.37
  Bottom 0.305: v14.45,26.82 29.12,26.82 35.32,33.01 v41.62,33.01
SWDIO  (via drill 0.35)
  Top 0.305: STLINKV2.3 4.46,20.58 5.99,22.11 5.99,23.41 11.22,28.64 v14.45,28.64 | v52.39,33.42 53.03,32.78 U1.34
  Bottom 0.305: v14.45,28.64 18.76,28.64 23.85,33.73 52.09,33.73 v52.39,33.42
TX  (via drill 0.35)
  Top 0.279: v61.87,29.23 60.16,27.52 U1.22
  Bottom 0.406: LORA.4 18.09,15.07 35.15,32.12 61.94,32.12 62.88,31.18 62.88,30.25 v61.87,29.23
TX1  (via drill 0.35)
  Top 0.254: v53.72,33.75 54.62,33.75 55.03,33.33 U1.30
  Bottom 0.305: U4.1 39.15,39.81 44.72,34.23 53.23,34.23 v53.72,33.75
V_BCKP
  Bottom 0.254: U4.5 28.41,49.97 20.39,41.96
  Bottom 0.305: 20.39,41.96 C6.2 C5.+
  Bottom 0.406: C5.+ 14.69,42.41 12.78,44.32 B1.+ 10.45,44.32 11.78,42.98 R5.1
VIN
  Top 0.406: D4.K 3.88,40.86 4.61,41.59 R9.B
  Top 1.27: 5.33,40.07 6.52,41.26 6.52,44.7 7.57,45.74 | D4.K 5.33,40.07 | 5V-REG1.3 10.78,48.95 7.57,45.74 | 5.33,40.07 C3.2 C8.2 10.38,40.07 11.04,39.41 11.04,38.13 3.3-REG2.3 | 7.57,45.74 7.57,52.44 13.19,58.06 51.45,58.06 66.38,43.13 POWER5.2 70.82,40.72 70.82,37.03 68.64,34.85 POWER4.2
XTAL1
  Top 0.305: U1.5 54.03,15.48 51.99,13.43 Q2.1 C10.1
XTAL2
  Top 0.305: U1.6 54.53,15.48 56.81,13.2 Q2.2 C9.1

### Text on the board
tNames: ANTENNA | (+) APOGEE (+) MAIN | POWER | + / / / / - | GND | DIO | AUX | CLK | 3V3
bNames: GND | VCC | AUX | TXD | RXD | M0 | M1 | Oğuz Kaan ATAY & Mehmet Ali AĞIRMAN